# Altium schematic sheet Robot_board.SchDoc
size A3
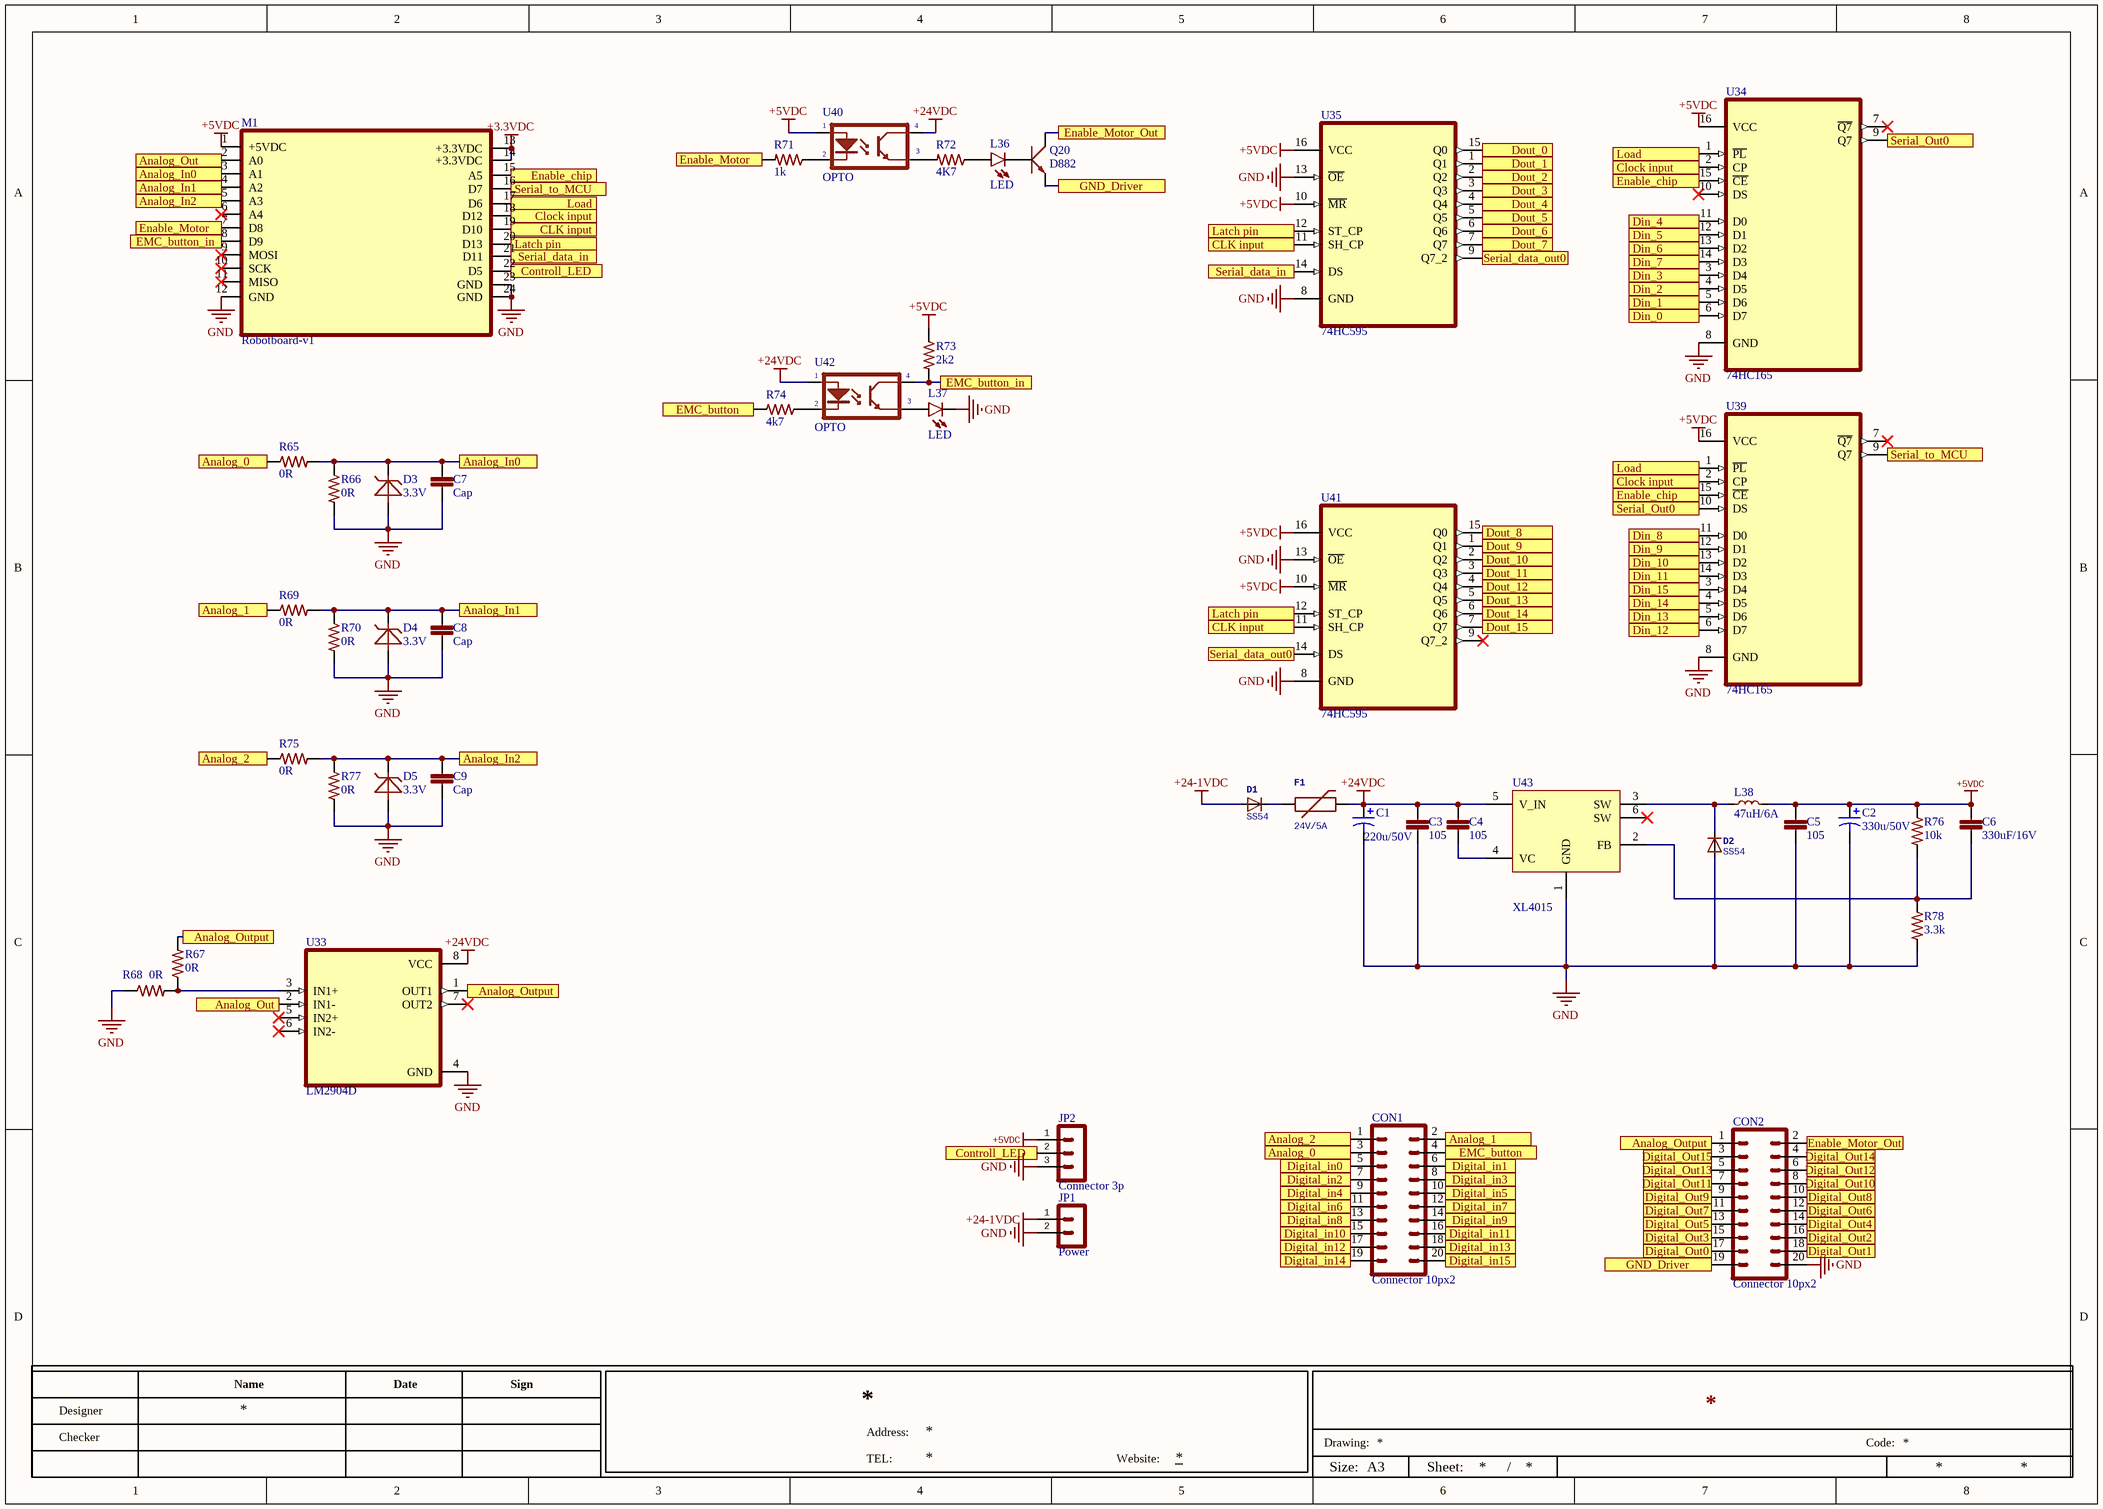
[diagram p0: Robot_board.SchDoc]

## Parts
C1  220u/50V  [CAP_SMD_8x10]
C2  330u/50V  [CAP_SMD_8x10]
C3  105  [CAP_SMD0603]
C4  105  [CAP_SMD0603]
C5  105  [CAP_SMD0603]
C6  330uF/16V  [CAP_SMD0603]
C7  Cap  [CAP_SMD0603]
C8  Cap  [CAP_SMD0603]
C9  Cap  [CAP_SMD0603]
CON1  Connector 10px2  [DG24-2KDS]
CON2  Connector 10px2  [DG24-2KDS]
D1  SS54  [SMB]
D2  SS54  [SMB]
D3  3.3V  [DIODE_ZENER_SMD]
D4  3.3V  [DIODE_ZENER_SMD]
D5  3.3V  [DIODE_ZENER_SMD]
F1  24V/5A  [1206]
JP1  Power  [KF-128_2P]
JP2  Connector 3p  [KF-128_3P]
L36  LED  [LED_GREEN_SMD_0603]
L37  LED  [LED_RED_SMD_0603]
L38  47uH/6A  [Inductor_47uH_6A]
M1  Robotboard-v1  [ROBOTBOARD_V1]
Q20  D882  [SOT89]
R65  0R  [RES_SMD0603]
R66  0R  [RES_SMD0603]
R67  0R  [RES_SMD0603]
R68  0R  [RES_SMD0603]
R69  0R  [RES_SMD0603]
R70  0R  [RES_SMD0603]
R71  1k  [RES_SMD0603]
R72  4K7  [RES_SMD0603]
R73  2k2  [RES_SMD0603]
R74  4k7  [RES_SMD0603]
R75  0R  [RES_SMD0603]
R76  10k  [RES_SMD0603]
R77  0R  [RES_SMD0603]
R78  3.3k  [RES_SMD0603]
U33  LM2904D  [SOIC 8]
U34  74HC165  [SOIC16]
U35  74HC595  [SOIC16]
U39  74HC165  [SOIC16]
U40  OPTO  [SOP4]
U41  74HC595  [SOIC16]
U42  OPTO  [SOP4]
U43  XL4015  [TO-263-5]

## Ports
Analog_0, Analog_1, Analog_2, Analog_In0, Analog_In1, Analog_In2, Analog_Out, Analog_Output, CLK input, Clock input, Controll_LED, Digital_in0, Digital_in1, Digital_in2, Digital_in3, Digital_in4, Digital_in5, Digital_in6, Digital_in7, Digital_in8, Digital_in9, Digital_in10, Digital_in11, Digital_in12, Digital_in13, Digital_in14, Digital_in15, Digital_Out0, Digital_Out1, Digital_Out2, Digital_Out3, Digital_Out4, Digital_Out5, Digital_Out6, Digital_Out7, Digital_Out8, Digital_Out9, Digital_Out10, Digital_Out11, Digital_Out12, Digital_Out13, Digital_Out14, Digital_Out15, Din_0, Din_1, Din_2, Din_3, Din_4, Din_5, Din_6, Din_7, Din_8, Din_9, Din_10, Din_11, Din_12, Din_13, Din_14, Din_15, Dout_0, Dout_1, Dout_2, Dout_3, Dout_4, Dout_5, Dout_6, Dout_7, Dout_8, Dout_9, Dout_10, Dout_11, Dout_12, Dout_13, Dout_14, Dout_15, EMC_button, EMC_button_in, Enable_chip, Enable_Motor, Enable_Motor_Out, GND_Driver, Latch pin, Load, Serial_data_in, Serial_data_out0, Serial_Out0, Serial_to_MCU

## Nets
+3.3VDC: M1.13(+3.3VDC) M1.14(+3.3VDC)
+5VDC: C2.1 C5.1 C6.1 JP2.1 L38.2 M1.1(+5VDC) R73.1 R76.1 U34.16(VCC) U35.10(~{MR}) U35.16(VCC) U39.16(VCC) U40.1(A) U41.10(~{MR}) U41.16(VCC)
+24-1VDC: D1.1 JP1.1
+24VDC: C1.1 C3.1 C4.1 F1.2 U33.8(VCC) U40.4(C) U42.1(A) U43.5(V_IN)
GND: C1.2 C2.2 C3.2 C5.2 C7.1 C8.1 C9.1 CON2.20 D2.1 D3.1 D4.1 D5.1 JP1.2 JP2.3 L37.2(POS) M1.12(GND) M1.23(GND) M1.24(GND) R66.2 R68.1 R70.2 R77.2 R78.2 U33.4(GND) U34.8(GND) U35.8(GND) U35.13(~{OE}) U39.8(GND) U41.8(GND) U41.13(~{OE}) U43.1(GND)
Analog_0: CON1.3 R65.1 ; port Analog_0
Analog_1: CON1.2 R69.1 ; port Analog_1
Analog_2: CON1.1 R75.1 ; port Analog_2
Analog_In0: C7.2 D3.2 M1.3(A1) R65.2 R66.1 ; port Analog_In0
Analog_In1: C8.2 D4.2 M1.4(A2) R69.2 R70.1 ; port Analog_In1
Analog_In2: C9.2 D5.2 M1.5(A3) R75.2 R77.1 ; port Analog_In2
Analog_Out: M1.2(A0) U33.2(IN1-) ; port Analog_Out
Analog_Output: CON2.1 R67.2 U33.1(OUT1) ; port Analog_Output
CLK input: M1.19(D10) U35.11(SH_CP) U41.11(SH_CP) ; port CLK input
Clock input: M1.18(D12) U34.2(CP) U39.2(CP) ; port Clock input
Controll_LED: JP2.2 M1.22(D5) ; port Controll_LED
Digital_in0: CON1.5 ; port Digital_in0
Digital_in1: CON1.6 ; port Digital_in1
Digital_in2: CON1.7 ; port Digital_in2
Digital_in3: CON1.8 ; port Digital_in3
Digital_in4: CON1.9 ; port Digital_in4
Digital_in5: CON1.10 ; port Digital_in5
Digital_in6: CON1.11 ; port Digital_in6
Digital_in7: CON1.12 ; port Digital_in7
Digital_in8: CON1.13 ; port Digital_in8
Digital_in9: CON1.14 ; port Digital_in9
Digital_in10: CON1.15 ; port Digital_in10
Digital_in11: CON1.16 ; port Digital_in11
Digital_in12: CON1.17 ; port Digital_in12
Digital_in13: CON1.18 ; port Digital_in13
Digital_in14: CON1.19 ; port Digital_in14
Digital_in15: CON1.20 ; port Digital_in15
Digital_Out0: CON2.17 ; port Digital_Out0
Digital_Out1: CON2.18 ; port Digital_Out1
Digital_Out2: CON2.16 ; port Digital_Out2
Digital_Out3: CON2.15 ; port Digital_Out3
Digital_Out4: CON2.14 ; port Digital_Out4
Digital_Out5: CON2.13 ; port Digital_Out5
Digital_Out6: CON2.12 ; port Digital_Out6
Digital_Out7: CON2.11 ; port Digital_Out7
Digital_Out8: CON2.10 ; port Digital_Out8
Digital_Out9: CON2.9 ; port Digital_Out9
Digital_Out10: CON2.8 ; port Digital_Out10
Digital_Out11: CON2.7 ; port Digital_Out11
Digital_Out12: CON2.6 ; port Digital_Out12
Digital_Out13: CON2.5 ; port Digital_Out13
Digital_Out14: CON2.4 ; port Digital_Out14
Digital_Out15: CON2.3 ; port Digital_Out15
Din_0: U34.6(D7) ; port Din_0
Din_1: U34.5(D6) ; port Din_1
Din_2: U34.4(D5) ; port Din_2
Din_3: U34.3(D4) ; port Din_3
Din_4: U34.11(D0) ; port Din_4
Din_5: U34.12(D1) ; port Din_5
Din_6: U34.13(D2) ; port Din_6
Din_7: U34.14(D3) ; port Din_7
Din_8: U39.11(D0) ; port Din_8
Din_9: U39.12(D1) ; port Din_9
Din_10: U39.13(D2) ; port Din_10
Din_11: U39.14(D3) ; port Din_11
Din_12: U39.6(D7) ; port Din_12
Din_13: U39.5(D6) ; port Din_13
Din_14: U39.4(D5) ; port Din_14
Din_15: U39.3(D4) ; port Din_15
Dout_0: U35.15(Q0) ; port Dout_0
Dout_1: U35.1(Q1) ; port Dout_1
Dout_2: U35.2(Q2) ; port Dout_2
Dout_3: U35.3(Q3) ; port Dout_3
Dout_4: U35.4(Q4) ; port Dout_4
Dout_5: U35.5(Q5) ; port Dout_5
Dout_6: U35.6(Q6) ; port Dout_6
Dout_7: U35.7(Q7) ; port Dout_7
Dout_8: U41.15(Q0) ; port Dout_8
Dout_9: U41.1(Q1) ; port Dout_9
Dout_10: U41.2(Q2) ; port Dout_10
Dout_11: U41.3(Q3) ; port Dout_11
Dout_12: U41.4(Q4) ; port Dout_12
Dout_13: U41.5(Q5) ; port Dout_13
Dout_14: U41.6(Q6) ; port Dout_14
Dout_15: U41.7(Q7) ; port Dout_15
EMC_button: CON1.4 R74.2 ; port EMC_button
EMC_button_in: M1.8(D9) R73.2 U42.4(C) ; port EMC_button_in
Enable_chip: M1.15(A5) U34.15(~{CE}) U39.15(~{CE}) ; port Enable_chip
Enable_Motor: M1.7(D8) R71.2 ; port Enable_Motor
Enable_Motor_Out: CON2.2 Q20.3(COLLECTOR) ; port Enable_Motor_Out
GND_Driver: CON2.19 Q20.2(EMITTER) ; port GND_Driver
Latch pin: M1.20(D13) U35.12(ST_CP) U41.12(ST_CP) ; port Latch pin
Load: M1.17(D6) U34.1(~{PL}) U39.1(~{PL}) ; port Load
Serial_data_in: M1.21(D11) U35.14(DS) ; port Serial_data_in
Serial_data_out0: U35.9(Q7_2) U41.14(DS) ; port Serial_data_out0
Serial_Out0: U34.9(Q7) U39.10(DS) ; port Serial_Out0
Serial_to_MCU: M1.16(D7) U39.9(Q7) ; port Serial_to_MCU
NetC4_2: C4.2 U43.4(VC)
NetC6_2: C6.2 R76.2 R78.1 U43.2(FB)
NetD1_2: D1.2 F1.1
NetD2_2: D2.2 L38.1 U43.3(SW)
NetL36_1: L36.1(NEG) R72.1
NetL36_2: L36.2(POS) Q20.1(BASE)
NetL37_1: L37.1(NEG) U42.3(E)
NetR67_1: R67.1 R68.2 U33.3(IN1+)
NetR71_1: R71.1 U40.2(K)
NetR72_2: R72.2 U40.3(E)
NetR74_1: R74.1 U42.2(K)

Not connected (* = marked no-connect by the designer): M1 6(A4)* 9(MOSI)* 10(SCK)* 11(MISO)*; U33 5(IN2+)* 6(IN2-)* 7(OUT2)*; U34 7(~{Q7})* 10(DS)*; U39 7(~{Q7})*; U41 9(Q7_2)*; U43 6(SW)*

## Notes on the sheet
- Name
- Date
- Sign
- Designer
- Checker
- Address:
- TEL:
- Website:
- Drawing:
- Size:
- A3
- Sheet:
- /
- Code:

## Library data of the parts
C1 C2 = Cap_Pol
C3-C6 = Cap
D1 D2 = DIODE
D3-D5 = DIODE_ZENER: Diode
F1 = Fuse
JP1 = Connector 2p
L36 L37 = LED: Lighting Eminter Diode
L38 = Inductors
Q20 = Tranzitor NPN: pin to pad: 2>3 3>2
R65-R78 = Resistor